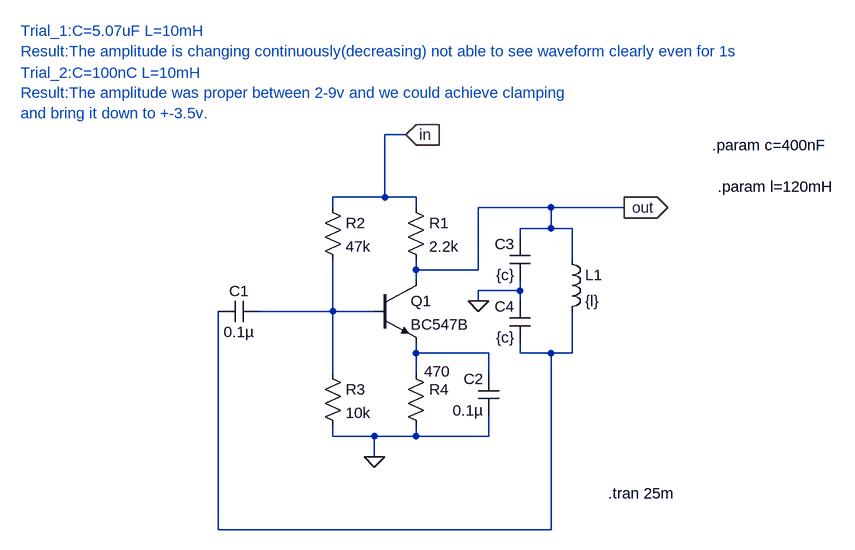
[diagram p0: schematic input.asc]
input.asc, the LTspice schematic file:
Version 4.1
SHEET 1 1072 680
WIRE 144 -176 112 -176
WIRE 112 -80 112 -176
WIRE 112 -80 32 -80
WIRE 160 -80 112 -80
WIRE 32 -64 32 -80
WIRE 160 -64 160 -80
WIRE 368 -64 256 -64
WIRE 480 -64 368 -64
WIRE 368 -32 368 -64
WIRE 368 -32 320 -32
WIRE 400 -32 368 -32
WIRE 320 -16 320 -32
WIRE 400 16 400 -32
WIRE 160 32 160 16
WIRE 256 32 256 -64
WIRE 256 32 160 32
WIRE 160 48 160 32
WIRE 320 64 320 48
WIRE 320 64 256 64
WIRE 256 80 256 64
WIRE 320 80 320 64
WIRE 32 96 32 16
WIRE 32 96 -80 96
WIRE 96 96 32 96
WIRE 160 160 160 144
WIRE 272 160 160 160
WIRE 320 160 320 144
WIRE 368 160 320 160
WIRE 400 160 400 96
WIRE 400 160 368 160
WIRE 32 192 32 96
WIRE 160 192 160 160
WIRE 272 192 272 160
WIRE 32 288 32 272
WIRE 96 288 32 288
WIRE 160 288 160 272
WIRE 160 288 96 288
WIRE 272 288 272 256
WIRE 272 288 160 288
WIRE 96 320 96 288
WIRE -144 432 -144 96
WIRE 368 432 368 160
WIRE 368 432 -144 432
FLAG 96 320 0
FLAG 256 80 0
FLAG 480 -64 out
IOPIN 480 -64 Out
FLAG 144 -176 in
IOPIN 144 -176 In
SYMBOL npn 96 48 R0
SYMATTR InstName Q1
SYMATTR Value BC547B
SYMBOL res 144 -80 R0
SYMATTR InstName R1
SYMATTR Value 2.2k
SYMBOL res 16 -80 R0
SYMATTR InstName R2
SYMATTR Value 47k
SYMBOL res 16 176 R0
SYMATTR InstName R3
SYMATTR Value 10k
SYMBOL res 144 176 R0
WINDOW 3 29 12 Left 2
SYMATTR Value 470
SYMATTR InstName R4
SYMBOL cap -80 80 R90
WINDOW 0 0 32 VBottom 2
WINDOW 3 32 32 VTop 2
SYMATTR InstName C1
SYMATTR Value 0.1µ
SYMBOL cap 288 256 R180
WINDOW 0 24 56 Left 2
WINDOW 3 24 8 Left 2
SYMATTR InstName C2
SYMATTR Value 0.1µ
SYMBOL cap 336 48 R180
WINDOW 0 24 56 Left 2
WINDOW 3 24 8 Left 2
SYMATTR InstName C3
SYMATTR Value {c}
SYMBOL cap 336 144 R180
WINDOW 0 24 56 Left 2
WINDOW 3 24 8 Left 2
SYMATTR InstName C4
SYMATTR Value {c}
SYMBOL ind 384 0 R0
SYMATTR InstName L1
SYMATTR Value {l}
TEXT 456 376 Left 2 !.tran 25m
TEXT -448 -336 Left 2 ;Trial_1:C=5.07uF L=10mH \nResult:The amplitude is changing continuously(decreasing) not able to see waveform clearly even for 1s
TEXT -448 -272 Left 2 ;Trial_2:C=100nC L=10mH \nResult:The amplitude was proper between 2-9v and we could achieve clamping\nand bring it down to +-3.5v.
TEXT 616 -160 Left 2 !.param c=400nF
TEXT 624 -96 Left 2 !.param l=120mH

The netlist it stands for:
* input.asc
Q1 out N001 N002 0 BC547B
R1 in out 2.2k
R2 in N001 47k
R3 N001 0 10k
R4 N002 0 470
C1 N001 N003 0.1µ
C2 0 N002 0.1µ
C3 0 out {c}
C4 N003 0 {c}
L1 out N003 {l}
.model NPN NPN
.model PNP PNP
.lib standard.bjt
.tran 25m
* Trial_1:C=5.07uF L=10mH
* Result:The amplitude is changing continuously(decreasing) not able to see waveform clearly even for 1s
* Trial_2:C=100nC L=10mH
* Result:The amplitude was proper between 2-9v and we could achieve clamping
* and bring it down to +-3.5v.
.param c=400nF
.param l=120mH
.backanno
.end